# Altium schematic sheet max10_schematic.SchDoc
size A4; SheetNumber: 1; SheetTotal: 1
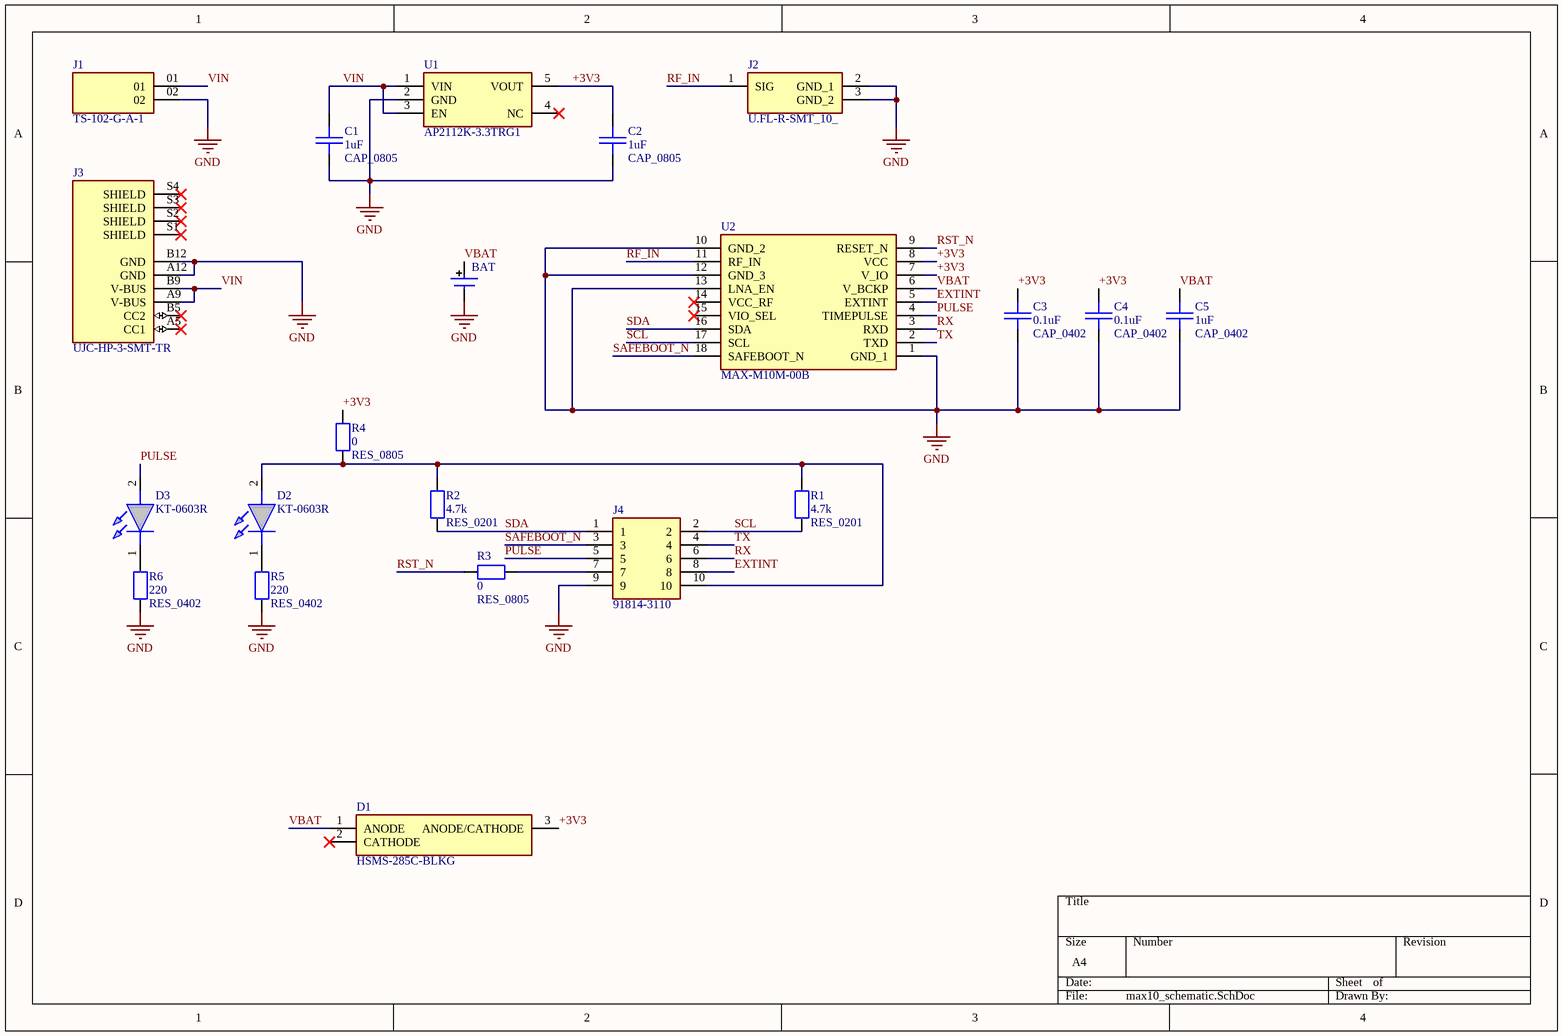
[diagram p0: max10_schematic.SchDoc]

## Parts
BAT  MECH_BT  [BT_MS621FE-FL11E]  (value not drawn)
C1  CAP_0805  value 1uF  [CAP_0805]
C2  CAP_0805  value 1uF  [CAP_0805]
C3  CAP_0402  value 0.1uF  [CAP_0402]
C4  CAP_0402  value 0.1uF  [CAP_0402]
C5  CAP_0402  value 1uF  [CAP_0402]
D1  HSMS-285C-BLKG  [SOT65P210X100-3N]
D2  KT-0603R  [LEDC1608X70N]
D3  KT-0603R  [LEDC1608X70N]
J1  TS-102-G-A-1  [SAMTEC_TS-102-G-A-1]
J2  U.FL-R-SMT_10_  [UFLRSMT10]
J3  UJC-HP-3-SMT-TR  [CUI_UJC-HP-3-SMT-TR]
J4  91814-3110  [918143110]
R1  RES_0201  value 4.7k  [RES_0201]
R2  RES_0201  value 4.7k  [RES_0201]
R3  RES_0805  value 0  [RES_0805]
R4  RES_0805  value 0  [RES_0805]
R5  RES_0402  value 220  [RES_0402]
R6  RES_0402  value 220  [RES_0402]
U1  AP2112K-3.3TRG1  [SOT95P285X140-5N]
U2  MAX-M10M-00B  [MAXM10M00B]

## Nets
GND: BAT.2 C1.1 C2.1 C3.1 C4.1 C5.1 J1.02 J2.2(GND_1) J2.3(GND_2) J3.A12(GND) J3.B12(GND) J4.9 R5.1 R6.1 U1.2(GND) U2.1(GND_1) U2.10(GND_2) U2.12(GND_3) U2.13(LNA_EN)
+3V3: C2.2 C3.2 C4.2 D1.3(ANODE/CATHODE) R4.2 U1.5(VOUT) U2.7(V_IO) U2.8(VCC)
EXTINT: J4.8 U2.5(EXTINT)
PULSE: D3.2(A) J4.5 U2.4(TIMEPULSE)
RF_IN: J2.1(SIG) U2.11(RF_IN)
RST_N: R3.1 U2.9(RESET_N)
RX: J4.6 U2.3(RXD)
SAFEBOOT_N: J4.3 U2.18(SAFEBOOT_N)
SCL: J4.2 R1.1 U2.17(SCL)
SDA: J4.1 R2.1 U2.16(SDA)
TX: J4.4 U2.2(TXD)
VBAT: BAT.1 C5.2 D1.1(ANODE) U2.6(V_BCKP)
VIN: C1.2 J1.01 J3.A9(V-BUS) J3.B9(V-BUS) U1.1(VIN) U1.3(EN)
NetD2_1: D2.1(K) R5.2
NetD2_2: D2.2(A) J4.10 R1.2 R2.2 R4.1
NetD3_1: D3.1(K) R6.2
NetJ4_7: J4.7 R3.2

Not connected (* = marked no-connect by the designer): D1 2(CATHODE)*; J3 A5(CC1)* B5(CC2)* S1(SHIELD)* S2(SHIELD)* S3(SHIELD)* S4(SHIELD)*; U1 4(NC)*; U2 14(VCC_RF)* 15(VIO_SEL)*

## Library data of the parts
BAT = MECH_BT: Battery; SCH_Footprint: *; Value: *
D1 = HSMS-285C-BLKG: BROADCOM LIMITED - HSMS-285C-BLKG - DIODE, SCHOTTKY, SOT-323; Manufacturer_Name: Avago Technologies; Geometry.Height: 1mm; Manufacturer_Part_Number: HSMS-285C-BLKG; Mouser Part Number: 630-HSMS-285C-BLKG; Mouser Price/Stock: https://www.mouser.co.uk/ProductDetail/Broadcom-Avago/HSMS-285C-BLKG?qs=RQ9zk%252B50r5G0GuS6%252Bi8wOg%3D%3D; Arrow Part Number: *; Arrow Price/Stock: *; Datasheet Link: https://datasheet.datasheetarchive.com/originals/distributors/Datasheets_SAMA/a18ba574cb231f6ca9f6e17d40f360bc.pdf
D2 D3 = KT-0603R: Red 615~630nm 1.9~2.2V 0603 Light Emitting Diodes (LED) RoHS; Manufacturer_Name: Hubei KENTO Elec; Geometry.Height: 0.7mm; Manufacturer_Part_Number: KT-0603R; Mouser Part Number: *; Mouser Price/Stock: *; Arrow Part Number: *; Arrow Price/Stock: *; Datasheet Link: https://datasheet.lcsc.com/szlcsc/Hubei-KENTO-Elec-KT-0603R_C2286.pdf
J1 = TS-102-G-A-1: MF: {'manufacturer': u'Samtec Inc.'}; Package: None; Price: None; Value: *; MP: TS-102-G-A-1; Availability: Unavailable
J2 = U.FL-R-SMT_10_: U.FL (UMCC) Connector Receptacle, Male Pin 50 Ohms Surface Mount Solder; Manufacturer_Name: Hirose; Manufacturer_Part_Number: U.FL-R-SMT(10); Geometry.Height: 1.45mm; Mouser Part Number: 798-U.FL-R-SMT10; Mouser Price/Stock: https://www.mouser.co.uk/ProductDetail/Hirose-Connector/U.FL-R-SMT10?qs=Ux3WWAnHpjBT1CWD8UMEMQ%3D%3D; Arrow Part Number: U.FL-R-SMT(10); Arrow Price/Stock: https://www.arrow.com/en/products/u.fl-r-smt-10/hirose-electric?utm_currency=USD&region=nac; Datasheet Link: https://eu.mouser.com/datasheet/2/185/hiros05388_1-2269186.pdf
J4 = 91814-3110: 2.54mm Pitch C-Grid III Dual Row Right-Angle Shrouded Header, 10 Circuits, Tin (Sn) over Nickel (Ni); Manufacturer_Name: Molex; Geometry.Height: 9.75mm; Manufacturer_Part_Number: 91814-3110; Mouser Part Number: 538-91814-3110; Mouser Price/Stock: https://www.mouser.co.uk/ProductDetail/Molex/91814-3110?qs=foBNLhhmJWj4K%2F9NKQ%252B3vQ%3D%3D; Arrow Part Number: *; Arrow Price/Stock: *; Datasheet Link: https://www.molex.com/pdm_docs/sd/918143110_sd.pdf
U1 = AP2112K-3.3TRG1: 600mA 3.3V LDO Regulator Enable SOT23-5 DiodesZetex AP2112K-3.3TRG1, LDO Voltage Regulator, 3.3 V +/-1.5%, 2.5  6 Vin, 5-Pin SOT-23; Manufacturer_Name: Diodes Incorporated; Geometry.Height: 1.4mm; Manufacturer_Part_Number: AP2112K-3.3TRG1; Mouser Part Number: 621-AP2112K-3.3TRG1; Mouser Price/Stock: https://www.mouser.co.uk/ProductDetail/Diodes-Incorporated/AP2112K-3.3TRG1?qs=x6A8l6qLYDDPYHosCdzh%2FA%3D%3D; Arrow Part Number: AP2112K-3.3TRG1; Arrow Price/Stock: https://www.arrow.com/en/products/ap2112k-3.3trg1/diodes-incorporated?utm_currency=USD&region=nac; Datasheet Link: https://www.diodes.com//assets/Datasheets/AP2112.pdf
U2 = MAX-M10M-00B: GPS Modules u-blox M10 GNSS LCC module, firmware in ROM, crystal oscillator; Geometry.Height: 2.7mm; Manufacturer_Name: u-blox; Manufacturer_Part_Number: MAX-M10M-00B; Mouser Part Number: 377-MAX-M10M-00B; Mouser Price/Stock: https://www.mouser.co.uk/ProductDetail/u-blox/MAX-M10M-00B?qs=A6eO%252BMLsxmQGh8%2FJ1ZmexA%3D%3D; Arrow Part Number: MAX-M10M-00B; Arrow Price/Stock: https://www.arrow.com/en/products/max-m10m-00b/u-blox?utm_currency=USD&region=nac; Datasheet Link: https://content.u-blox.com/sites/default/files/documents/MAX-M10M_IntegrationManual_UBX-22038241.pdf
C1 C2 = CAP_0805: LCSC: *; Tolerance: *; Voltage Rating: *; Capacitor Type: *
C3-C5 = CAP_0402: LCSC: *; Tolerance: *; Voltage Rating: *; Capacitor Type: *
J3 = UJC-HP-3-SMT-TR: Package: None; Price: None; Value: *; MP: UJC-HP-3-SMT-TR; Availability: Unavailable
R1 R2 = RES_0201: LCSC: *; Tolerance: *; Voltage Rating: *
R3 R4 = RES_0805: LCSC: *; Tolerance: *; Voltage Rating: *
R5 R6 = RES_0402: LCSC: *; Tolerance: *; Voltage Rating: *